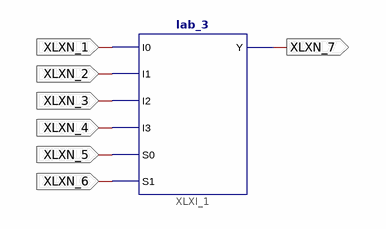
[diagram p0: schematic sheet 1]
// Xilinx ISE schematic esquema.sch (xbr) as structural Verilog: 1 symbols, 7 ports
module esquema (
  input  XLXN_1,
  input  XLXN_2,
  input  XLXN_3,
  input  XLXN_4,
  input  XLXN_5,
  input  XLXN_6,
  output XLXN_7
);

  lab_3 XLXI_1 (.I0(XLXN_1), .I1(XLXN_2), .I2(XLXN_3), .I3(XLXN_4), .S0(XLXN_5), .S1(XLXN_6), .Y(XLXN_7));
endmodule
